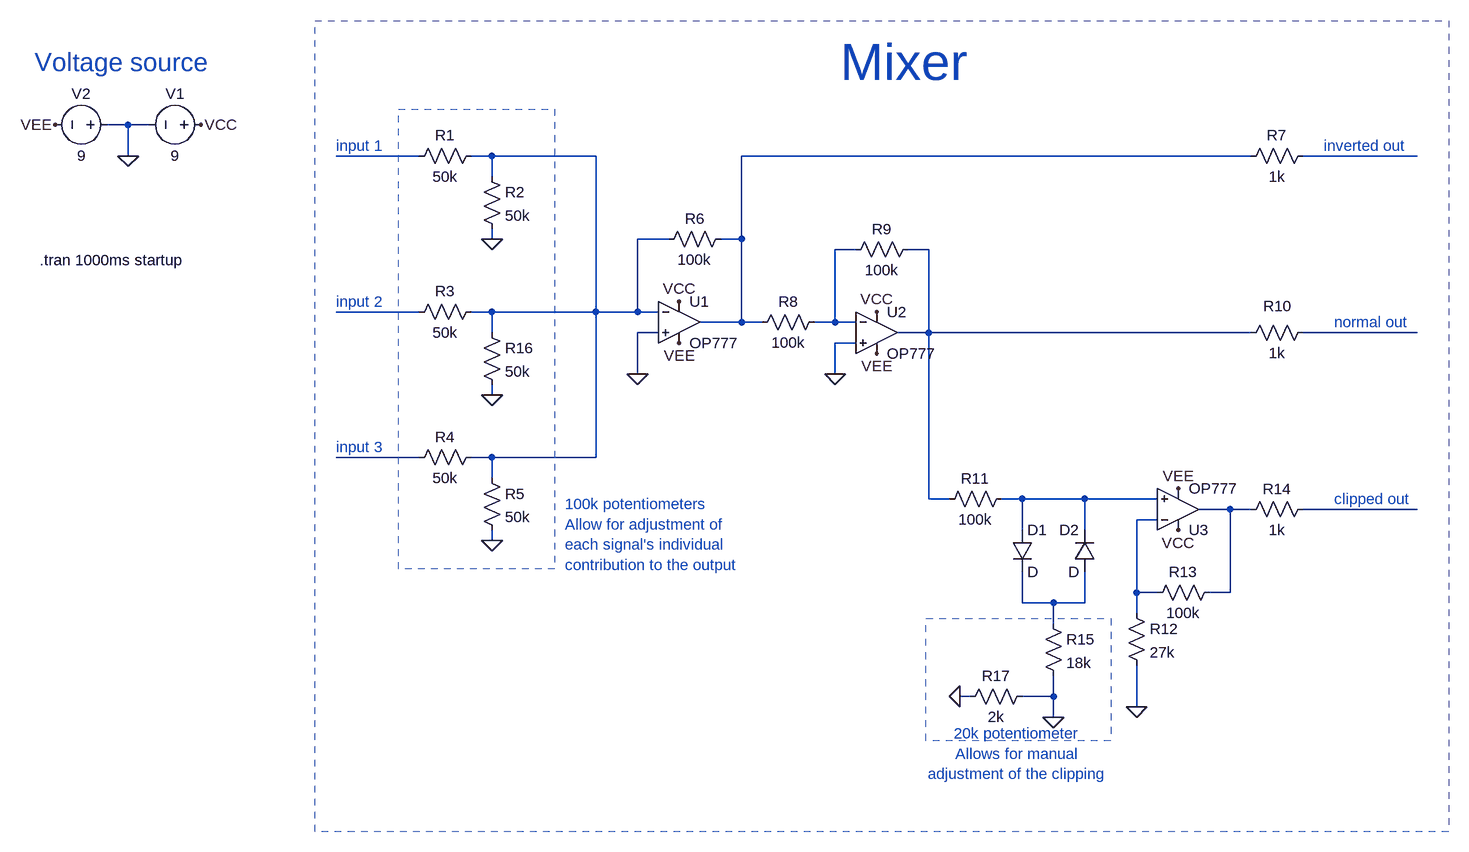
[diagram p0: schematic mixer-simulation.asc]
mixer-simulation.asc, the LTspice schematic file:
Version 4.1
SHEET 1 1716 1064
WIRE -320 -144 -352 -144
WIRE -288 -144 -320 -144
WIRE -320 -96 -320 -144
WIRE 128 -96 0 -96
WIRE 240 -96 208 -96
WIRE 400 -96 240 -96
WIRE 1408 -96 624 -96
WIRE 1664 -96 1488 -96
WIRE 240 -64 240 -96
WIRE 240 32 240 16
WIRE 512 32 464 32
WIRE 624 32 624 -96
WIRE 624 32 592 32
WIRE 800 48 768 48
WIRE 912 48 880 48
WIRE 128 144 0 144
WIRE 240 144 208 144
WIRE 400 144 400 -96
WIRE 400 144 240 144
WIRE 464 144 464 32
WIRE 464 144 400 144
WIRE 496 144 464 144
WIRE 624 160 624 32
WIRE 624 160 560 160
WIRE 656 160 624 160
WIRE 768 160 768 48
WIRE 768 160 736 160
WIRE 800 160 768 160
WIRE 240 176 240 144
WIRE 496 176 464 176
WIRE 912 176 912 48
WIRE 912 176 864 176
WIRE 1408 176 912 176
WIRE 1664 176 1488 176
WIRE 800 192 768 192
WIRE 464 240 464 176
WIRE 768 240 768 192
WIRE 240 272 240 256
WIRE 128 368 0 368
WIRE 240 368 208 368
WIRE 400 368 400 144
WIRE 400 368 240 368
WIRE 240 400 240 368
WIRE 912 432 912 176
WIRE 944 432 912 432
WIRE 1056 432 1024 432
WIRE 1152 432 1056 432
WIRE 1264 432 1152 432
WIRE 1376 448 1328 448
WIRE 1408 448 1376 448
WIRE 1664 448 1488 448
WIRE 1264 464 1232 464
WIRE 1056 480 1056 432
WIRE 1152 480 1152 432
WIRE 240 496 240 480
WIRE 1232 576 1232 464
WIRE 1264 576 1232 576
WIRE 1376 576 1376 448
WIRE 1376 576 1344 576
WIRE 1056 592 1056 544
WIRE 1104 592 1056 592
WIRE 1152 592 1152 544
WIRE 1152 592 1104 592
WIRE 1232 608 1232 576
WIRE 1104 624 1104 592
WIRE 976 736 960 736
WIRE 1104 736 1104 704
WIRE 1104 736 1056 736
WIRE 1232 752 1232 688
WIRE 1104 768 1104 736
FLAG 240 32 0
FLAG 240 272 0
FLAG 240 496 0
FLAG 464 240 0
FLAG 768 240 0
FLAG 1232 752 0
FLAG 528 128 VCC
FLAG 832 144 VCC
FLAG 1296 480 VCC
FLAG 1296 416 VEE
FLAG 528 192 VEE
FLAG 832 208 VEE
FLAG 960 736 0
FLAG 1104 768 0
FLAG -432 -144 VEE
FLAG -208 -144 VCC
FLAG -320 -96 0
SYMBOL Res 224 -112 R90
WINDOW 0 0 56 VBottom 2
WINDOW 3 32 56 VTop 2
SYMATTR InstName R1
SYMATTR Value 50k
SYMBOL Res 224 -80 R0
SYMATTR InstName R2
SYMATTR Value 50k
SYMBOL Res 112 160 R270
WINDOW 0 32 56 VTop 2
WINDOW 3 0 56 VBottom 2
SYMATTR InstName R3
SYMATTR Value 50k
SYMBOL Res 224 352 R90
WINDOW 0 0 56 VBottom 2
WINDOW 3 32 56 VTop 2
SYMATTR InstName R4
SYMATTR Value 50k
SYMBOL Res 224 384 R0
SYMATTR InstName R5
SYMATTR Value 50k
SYMBOL Res 608 16 R90
WINDOW 0 0 56 VBottom 2
WINDOW 3 32 56 VTop 2
SYMATTR InstName R6
SYMATTR Value 100k
SYMBOL Res 1504 -112 R90
WINDOW 0 0 56 VBottom 2
WINDOW 3 32 56 VTop 2
SYMATTR InstName R7
SYMATTR Value 1k
SYMBOL Res 752 144 R90
WINDOW 0 0 56 VBottom 2
WINDOW 3 32 56 VTop 2
SYMATTR InstName R8
SYMATTR Value 100k
SYMBOL Res 896 32 R90
WINDOW 0 0 56 VBottom 2
WINDOW 3 32 56 VTop 2
SYMATTR InstName R9
SYMATTR Value 100k
SYMBOL Res 1504 160 R90
WINDOW 0 -9 55 VBottom 2
WINDOW 3 32 56 VTop 2
SYMATTR InstName R10
SYMATTR Value 1k
SYMBOL Res 1040 416 R90
WINDOW 0 0 56 VBottom 2
WINDOW 3 32 56 VTop 2
SYMATTR InstName R11
SYMATTR Value 100k
SYMBOL Diode 1040 480 R0
SYMATTR InstName D1
SYMBOL Diode 1168 544 R180
WINDOW 0 24 64 Left 2
WINDOW 3 24 0 Left 2
SYMATTR InstName D2
SYMBOL Res 1216 592 R0
SYMATTR InstName R12
SYMATTR Value 27k
SYMBOL Res 1360 560 R90
WINDOW 0 0 56 VBottom 2
WINDOW 3 32 56 VTop 2
SYMATTR InstName R13
SYMATTR Value 100k
SYMBOL Res 1504 432 R90
WINDOW 0 0 56 VBottom 2
WINDOW 3 32 56 VTop 2
SYMATTR InstName R14
SYMATTR Value 1k
SYMBOL Res 1088 608 R0
SYMATTR InstName R15
SYMATTR Value 18k
SYMBOL OpAmps/OP777 528 96 R0
SYMATTR InstName U1
SYMBOL OpAmps/OP777 832 112 R0
SYMATTR InstName U2
SYMBOL OpAmps/OP777 1296 512 M180
SYMATTR InstName U3
SYMBOL res 224 160 R0
SYMATTR InstName R16
SYMATTR Value 50k
SYMBOL res 1072 720 R90
WINDOW 0 0 56 VBottom 2
WINDOW 3 32 56 VTop 2
SYMATTR InstName R17
SYMATTR Value 2k
SYMBOL voltage -192 -144 R90
WINDOW 0 -32 56 VBottom 2
WINDOW 3 32 56 VTop 2
SYMATTR InstName V1
SYMATTR Value 9
SYMBOL voltage -336 -144 R90
WINDOW 0 -32 56 VBottom 2
WINDOW 3 32 56 VTop 2
SYMATTR InstName V2
SYMATTR Value 9
TEXT 352 440 Left 2 ;100k potentiometers\nAllow for adjustment of\neach signal's individual\ncontribution to the output
TEXT 1048 824 Center 2 ;20k potentiometer\nAllows for manual\nadjustment of the clipping
TEXT 1520 -112 Left 2 ;inverted out
TEXT 1536 160 Left 2 ;normal out
TEXT 1536 432 Left 2 ;clipped out
TEXT 776 -240 Left 6 ;Mixer
TEXT 0 -112 Left 2 ;input 1
TEXT 0 128 Left 2 ;input 2
TEXT 0 352 Left 2 ;input 3
TEXT -456 64 Left 2 !.tran 1000ms startup
TEXT -464 -240 Left 4 ;Voltage source
RECTANGLE Normal 908 616 1192 804 2
RECTANGLE Normal 96 -168 336 540 2
RECTANGLE Normal 1712 944 -32 -304 2

The netlist it stands for:
* mixer-simulation.asc
R1 N002 N001 50k
R2 N002 0 50k
R3 N007 N002 50k
R4 N002 N009 50k
R5 N002 0 50k
R6 N003 N002 100k
R7 N004 N003 1k
R8 N005 N003 100k
R9 N006 N005 100k
R10 N008 N006 1k
R11 N010 N006 100k
D1 N010 N014 D
D2 N014 N010 D
R12 N013 0 27k
R13 N011 N013 100k
R14 N012 N011 1k
R15 N014 0 18k
X§U1 0 N002 VCC VEE N003 OP777  ; pins In+ In- V+ V- OUT
X§U2 0 N005 VCC VEE N006 OP777  ; pins In+ In- V+ V- OUT
X§U3 N010 N013 VCC VEE N011 OP777  ; pins In+ In- V+ V- OUT
R16 N002 0 50k
R17 0 0 2k
V1 VCC 0 9
V2 0 VEE 9
.model D D
.lib standard.dio
* 100k potentiometers
* Allow for adjustment of
* each signal's individual
* contribution to the output
* 20k potentiometer
* Allows for manual
* adjustment of the clipping
* inverted out
* normal out
* clipped out
* Mixer
* input 1
* input 2
* input 3
.tran 1000ms startup
* Voltage source
.lib ADI.lib
.backanno
.end